# EAGLE design VAR-PBB_v01 (EAGLE 9.5.2)
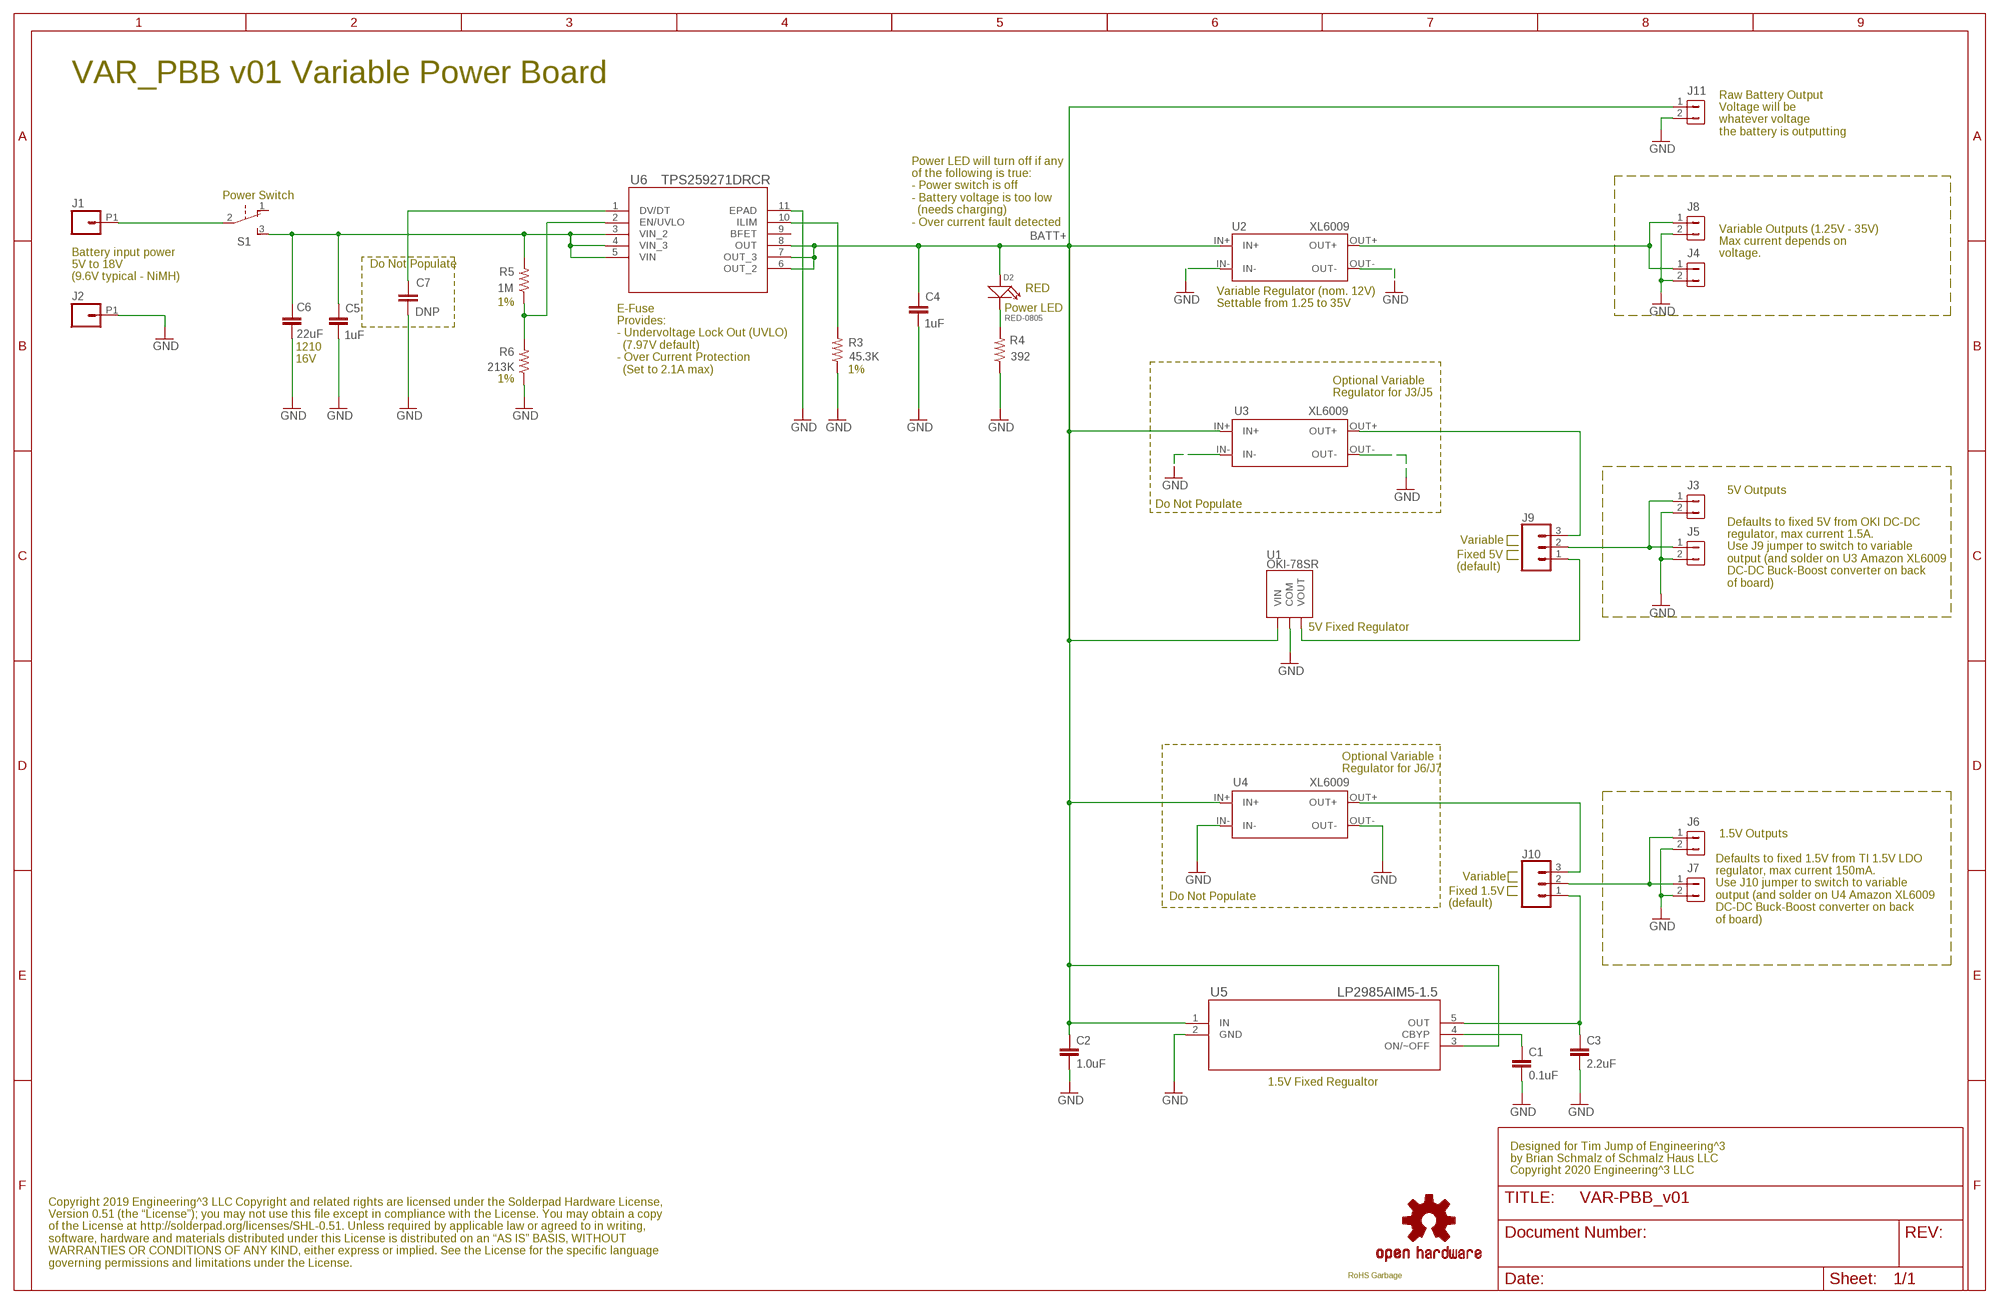
[diagram p0: schematic, sheet 1]

## Parts
C1  0.1uF  0.1UF-0603-25V-5%  [0603]
C2  1.0uF  1.0UF-0603-16V-10%  [0603]
C3  2.2uF  2.2UF-0603-10V-20%  [0603]
C4  1uF  0.1UF-0603-25V-5%  [0603]
C5  1uF  0.1UF-0603-25V-5%  [0603]
C6  22uF  22UF-1210-16V-20%  [1210]
C7  DNP  0.1UF-0603-25V-5%  [0603]
D2  RED-0805  SMD-LED-CLEAR-RED(0805)  [LED-0805]
J1  ANDERSON_POWER_POLE  [ANDERSON_POWER_POLE]
J2  ANDERSON_POWER_POLE  [ANDERSON_POWER_POLE]
J3  CON1X2_SHROUDED  [HEADER_1X2_SHROUDED]
J4  CON1X2_SHROUDED  [HEADER_1X2_SHROUDED]
J5  CON1X2_SHROUDED  [HEADER_1X2_SHROUDED]
J6  CON1X2_SHROUDED  [HEADER_1X2_SHROUDED]
J7  CON1X2_SHROUDED  [HEADER_1X2_SHROUDED]
J8  CON1X2_SHROUDED  [HEADER_1X2_SHROUDED]
J9  CONN_03  [1X03]
J10  CONN_03  [1X03]
J11  CON1X2_SHROUDED  [HEADER_1X2_SHROUDED]
LOGO2  OSHW-LOGOM  [OSHW-LOGO-M]
R3  45.3K  RESISTOR0603  [0603]
R4  392  RESISTOR0603  [0603]
R5  1M  RESISTOR0603  [0603]
R6  213K  RESISTOR0603  [0603]
S1  SWITCH_SLIDE_ON_ON  [SWITCH_SLIDE_RA]
U1  OKI-78SR  [OKI-78SR_REGULATOR_HORIZONTAL]
U2  XL6009  [XL6009_MODULE]
U3  XL6009  [XL6009_MODULE]
U4  XL6009  [XL6009_MODULE]
U5  LP2985AIM5-1.5  [MF05A]
U6  TPS259271DRCR  [DRC10_1P65X2P40]
U$6  ROHS_GARBAGE  [ROHS_GARBAGE_5MM]

## Nets
1.5V_REG: C3.1 J10.1 U5.5(OUT)
5V_REG: J9.1 U1.P$3(VOUT)
BATT+: C2.1 C4.2 D2.+ J11.1 U1.P$1(VIN) U2.IN+ U3.IN+ U4.IN+ U5.1(IN) U5.3(ON/~OFF) U6.6(OUT_2) U6.7(OUT_3) U6.8(OUT)
CHANNEL3: J3.1 J5.1 J9.2
CHANNEL4: J6.1 J7.1 J10.2
GND: C1.2 C2.2 C3.2 C4.1 C5.1 C6.2 C7.1 J2.P1 J3.2 J4.2 J5.2 J6.2 J7.2 J8.2 J11.2 R3.1 R4.1 R6.1 U1.P$2(COM) U2.IN- U2.OUT- U3.IN- U3.OUT- U4.IN- U4.OUT- U5.2(GND) U6.11(EPAD)
N$1: C5.2 C6.1 R5.2 S1.3(S) U6.3(VIN_2) U6.4(VIN_3) U6.5(VIN)
N$2: D2.- R4.2
N$3: J9.3 U3.OUT+
N$4: R5.1 R6.2 U6.2(EN/UVLO)
N$5: J4.1 J8.1 U2.OUT+
N$7: J10.3 U4.OUT+
N$8: C1.1 U5.4(CBYP)
N$11: J1.P1 S1.2(P)
N$12: R3.2 U6.10(ILIM)
N$14: C7.2 U6.1(DV/DT)
Unconnected: S1.1(O) U6.9(BFET)

## Notes on the sheet
- VAR_PBB v01 Variable Power Board
- Raw Battery Output
  Voltage will be 
  whatever voltage
  the battery is outputting
- Power Switch
- Power LED will turn off if any 
  of the following is true:
  - Power switch is off
  - Battery voltage is too low 
    (needs charging)
  - Over current fault detected
- Variable Outputs (1.25V - 35V)
  Max current depends on
  voltage.
- Do Not Populate
- Battery input power
  5V to 18V
  (9.6V typical - NiMH)
- RED
- 1%
- Variable Regulator (nom. 12V)
  Settable from 1.25 to 35V
- Power LED
- 1210
  16V
- E-Fuse
  Provides:
  - Undervoltage Lock Out (UVLO)
    (7.97V default)
  - Over Current Protection
    (Set to 2.1A max)
- 1%
- 1%
- Optional Variable
  Regulator for J3/J5
- 5V Outputs
- Do Not Populate
- Variable
- Fixed 5V
  (default)
- Defaults to fixed 5V from OKI DC-DC
  regulator, max current 1.5A.
  Use J9 jumper to switch to variable
  output (and solder on U3 Amazon XL6009 
  DC-DC Buck-Boost converter on back 
  of board)
- 5V Fixed Regulator
- Optional Variable
  Regulator for J6/J7
- 1.5V Outputs
- Variable
- Do Not Populate
- Fixed 1.5V
  (default)
- Defaults to fixed 1.5V from TI 1.5V LDO
  regulator, max current 150mA.
  Use J10 jumper to switch to variable
  output (and solder on U4 Amazon XL6009 
  DC-DC Buck-Boost converter on back 
  of board)
- 1.5V Fixed Regualtor
- Designed for Tim Jump of Engineering^3
  by Brian Schmalz of Schmalz Haus LLC
- Copyright 2020 Engineering^3 LLC
- Copyright 2019 Engineering^3 LLC Copyright and related rights are licensed under the Solderpad Hardware License, 
  Version 0.51 (the “License”); you may not use this file except in compliance with the License. You may obtain a copy 
  of the License at http://solderpad.org/licenses/SHL-0.51. Unless required by applicable law or agreed to in writing, 
  software, hardware and materials distributed under this License is distributed on an “AS IS” BASIS, WITHOUT 
  WARRANTIES OR CONDITIONS OF ANY KIND, either express or implied. See the License for the specific language 
  governing permissions and limitations under the License.

## Library data of the parts
C1 = SparkFun-Capacitors:0.1UF: 0.1µF ceramic capacitors A capacitor is a passive two-terminal electrical component used to store electrical energy temporarily in an electric field.; PROD_ID: CAP-08604
C2 = SparkFun-Capacitors:1.0UF: 1µF ceramic capacitors A capacitor is a passive two-terminal electrical component used to store electrical energy temporarily in an electric field.; PROD_ID: CAP-00868
C3 = SparkFun-Capacitors:2.2UF: 2.2µF ceramic capacitors A capacitor is a passive two-terminal electrical component used to store electrical energy temporarily in an electric field.; PROD_ID: CAP-07888
C4 C5 C7 = SparkFun-Capacitors:0.1UF: 0.1µF ceramic capacitors A capacitor is a passive two-terminal electrical component used to store electrical energy temporarily in an electric field.; PROD_ID: CAP-08604; VALUE: 0.1uF
C6 = SparkFun-Capacitors:22UF: 22µF ceramic capacitors A capacitor is a passive two-terminal electrical component used to store electrical energy temporarily in an electric field.
D2 = OPL_Optoelectronics:SMD-LED-CLEAR-RED(0805): 304090046; MPN: 17-215SURC/S530-A2/TR8
J1 J2 = JLY Parts:ANDERSON_POWER_POLE
J3-J8 J11 = JLY Parts:CON1X2_SHROUDED: CONN HDR RT ANG 2POS .100 TIN, Shrouded, Molex 70553-0036
J9 J10 = SparkFun-Connectors:CONN_03: Multi connection point. Often used as Generic Header-pin footprint for 0.1 inch spaced/style header connections On any of the 0.1 inch spaced packages, you can populate with these: Break Away Headers - Straight <https://www.sparkfun.com/products/116> (PRT-00116) Break Away Male Headers - Right Angle <https://www.sparkfun.com/products/553> (PRT-00553) Female Headers <https://www.sparkfun.com/products/115> (PRT-00115) Break Away Headers - Machine Pin <https://www.sparkfun.com/products/117> (PRT-00117) Break Away Female Headers - Swiss Machine Pin <https://www.sparkfun.com/products/743> (PRT-00743) Stackable Header - 3 Pin (Female, 0.1") <https://www.sparkfun.com/products/13875> (PRT-13875) For SCREWTERMINALS and SPRING TERMINALS visit here: Screw Terimnals on SparkFun.com <https://www.sparkfun.com/search/results?term=Screw+Terminals> (5mm/3.5mm/2.54mm spacing) This device is also useful as a general connection point to wire up your design to another part of your project. Our various solder wires solder well into these plated through hole pads. Hook-Up Wire - Assortment (Stranded, 22 AWG) <https://www.sparkfun.com/products/11375> (PRT-11375) Hook-Up Wire - Assortment (Solid Core, 22 AWG) <https://www.sparkfun.com/products/11367> (PRT-11367) View the entire wire category on our website here <https://www.sparkfun.com/categories/141> Special notes: Molex polarized connector foot print use with SKU : PRT-08232 with associated crimp pins and housings.
LOGO2 = SparkFun-Aesthetics:OSHW-LOGO: Open-Source Hardware (OSHW) Logo This logo indicates the piece of hardware it is found on incorporates a OSHW license and/or adheres to the definition of open source hardware found here: http://freedomdefined.org/OSHW
R3-R6 = SparkFun-Resistors:RESISTOR: Generic Resistor Package
S1 = JLY Parts:SWITCH_SLIDE_ON_ON: E-Switch Digikey EG2478-ND 500SSP1S1M6QEA SWITCH SLIDE SPDT SILVR 5A RTANG 500 E-Switch
U1 = OKI-78sr_Regulator:OKI-78SR
U2-U4 = XL6009_DC-DC:XL6009
U5 = LP2985AIM5-1.5:LP2985AIM5-1.5; BUILT_BY: EMA_UL_Team; COPYRIGHT: Copyright (C) 2018 Accelerated Designs. All rights reserved; MANUFACTURER_PART_NUMBER: LP2985AIM5-1.5; VENDOR: Texas Instruments
U6 = TPS259271DRCR:TPS259271DRCR; BUILT_BY: EMA_Molly; COPYRIGHT: Copyright (C) 2018 Accelerated Designs. All rights reserved; MANUFACTURER_PART_NUMBER: TPS259271DRCR; VENDOR: Texas Instruments
U$6 = SchmalzHausPublic:ROHS_GARBAGE

## Board
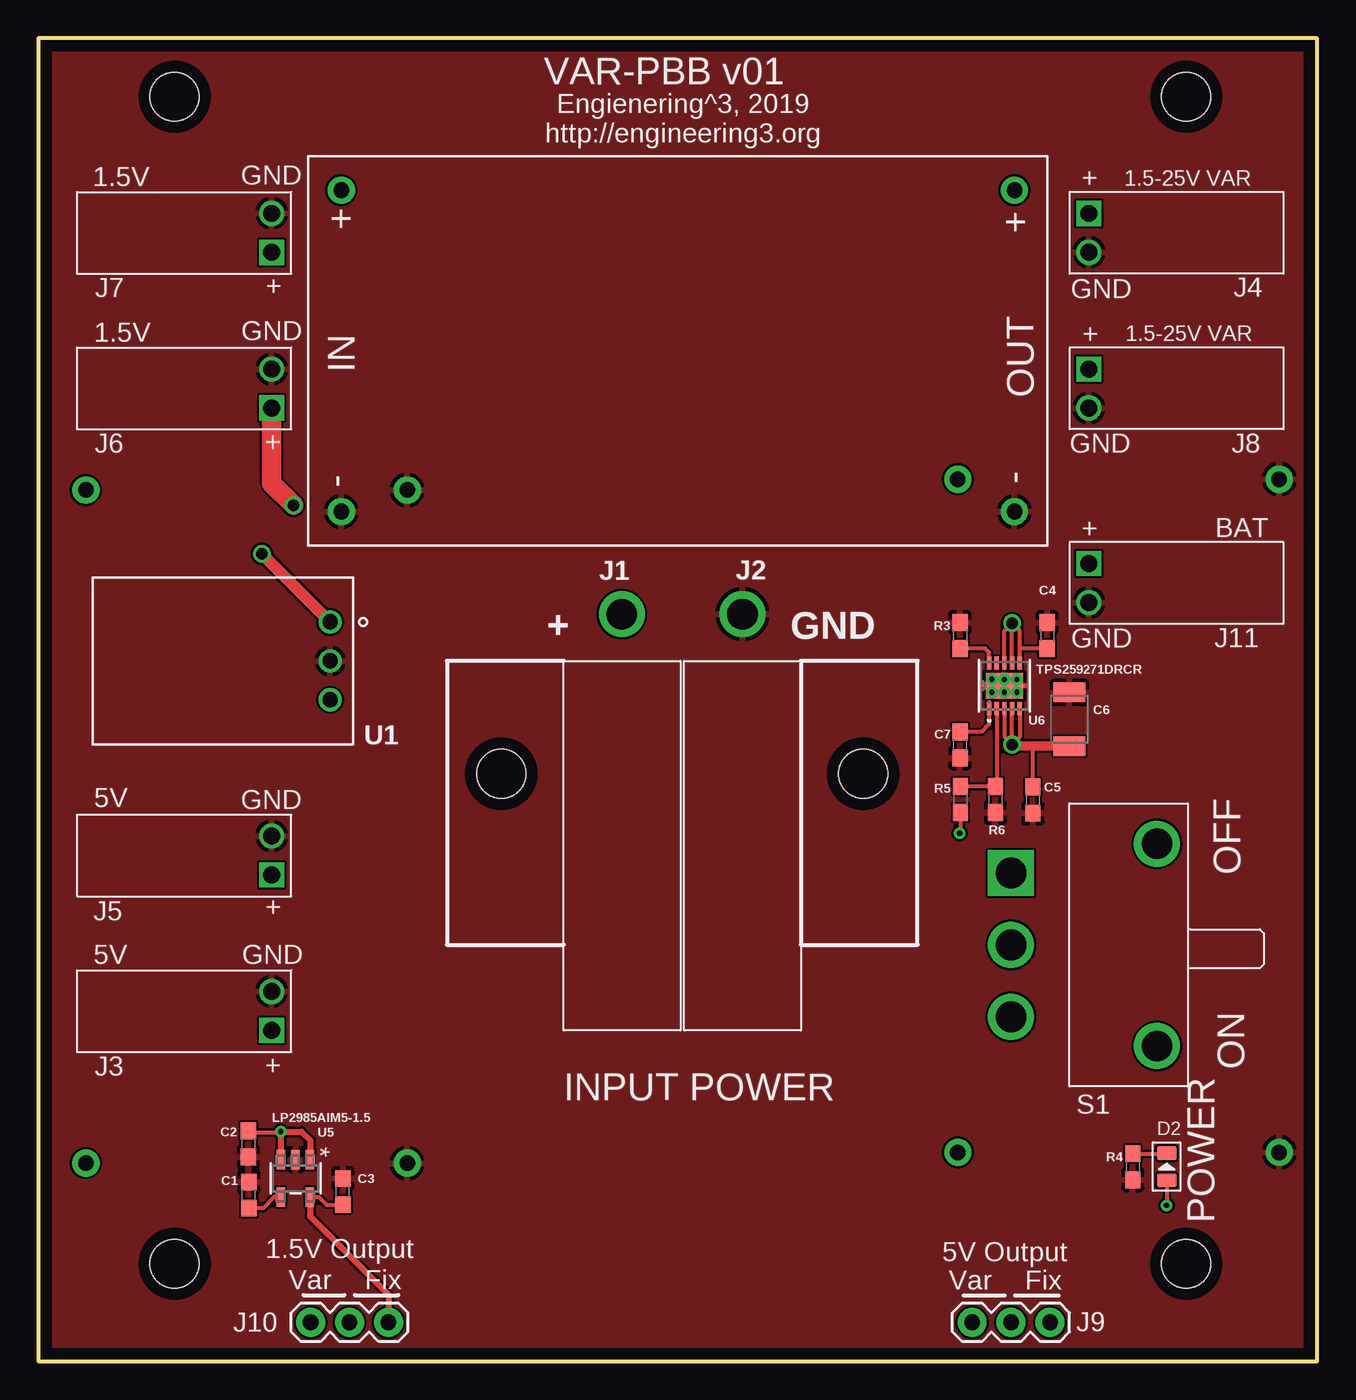
[diagram p1: board, top side]
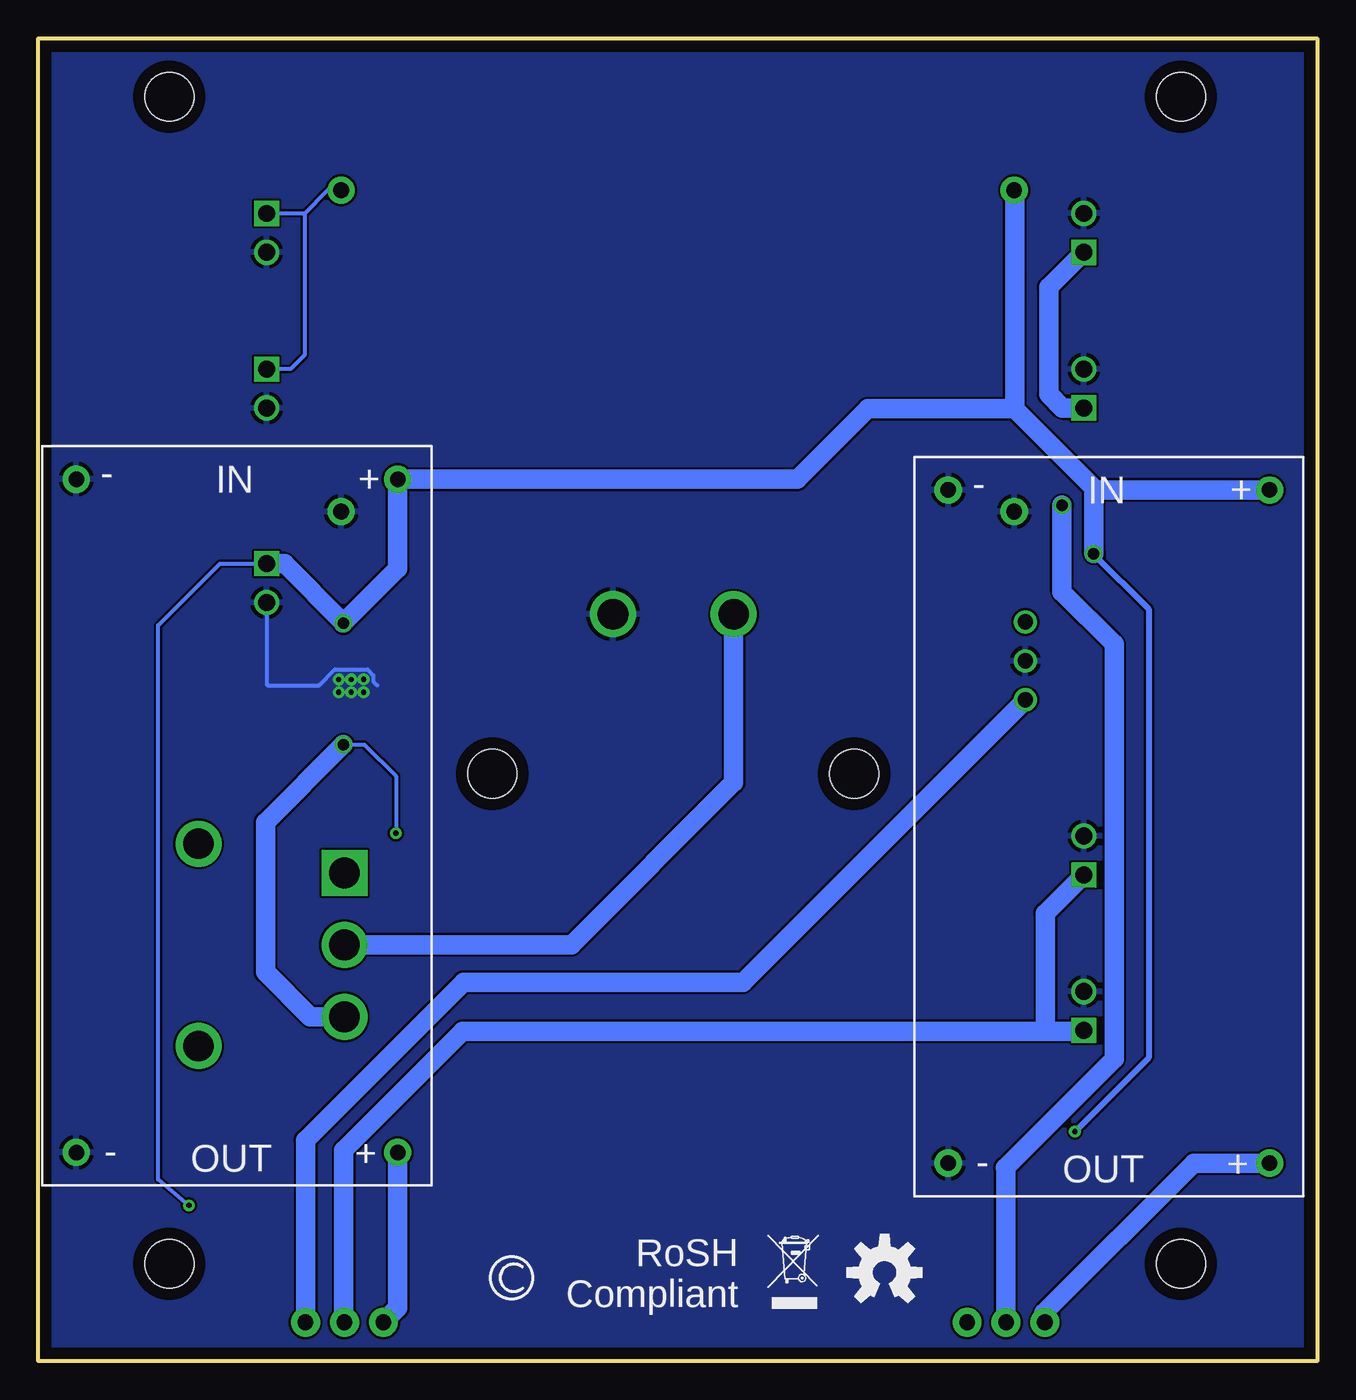
[diagram p2: board, bottom side, seen from below]

Size 83.49 x 86.36 mm. Coordinates in mm from the lower left corner, seen from the top.
Outline: 0,0 83.49,0 83.49,86.36 0,86.36 0,0
Copper layers (1*16): Top 0.035mm / dielectric 1.5mm / Bottom 0.035mm
Design rules "default *": minimum track width 10mil, minimum drill 10mil, track to track 6mil, track to pad 6mil, pad to pad 6mil, via to via 7mil, smd to smd 6mil, copper to edge 30mil, drill to drill 8mil, minimum pad ring 10mil, minimum via ring 8mil, stop-mask expansion 4mil, vias tented up to drill 0mil, thermal gap 10mil
Holes 3.2 mm at 53.85,38.35 30.23,38.35
Holes 3.17 mm at 8.89,82.55 74.93,82.55 74.93,6.35 8.89,6.35

### Footprints (pad centres in the part's own frame; a part is rotated, then mirrored left to right if it is on the bottom)
0603 = smd 1.1 x 1: 1 -0.85,0; 2 0.85,0
1210 = smd 1.27 x 2.06: 1 -1.755,0; 2 1.755,0
LED-0805 = smd 0.889 x 1.27: + -0.889,0; - 0.889,0
ANDERSON_POWER_POLE = drill 2: P1 -1.778,0
HEADER_1X2_SHROUDED = drill 1.1 square: 1 0,-1.27 | drill 1.1: 2 0,1.27
1X03 = drill 1.016 pad 1.88: 1 0,0; 2 2.54,0; 3 5.08,0
SWITCH_SLIDE_RA = drill 2 square: 1 -4.699,0 | drill 2: 2 0,0; 3 4.699,0; NC1 -6.604,9.525; NC2 6.604,9.525
OKI-78SR_REGULATOR_HORIZONTAL = drill 1: P$1 2.54,0; P$2 0,0; P$3 -2.54,0
XL6009_MODULE = drill 1.016 pad 1.778: IN+ 10.49,21.971; IN- -10.49,21.971; OUT+ 10.49,-21.971; OUT- -10.49,-21.971
MF05A = smd 1.27 x 0.559: 1 -1.219,0.953; 2 -1.219,0; 3 -1.219,-0.953; 4 1.219,-0.953; 5 1.219,0.953
DRC10_1P65X2P40 = smd 0.85 x 0.28: 1 -1.475,1; 2 -1.475,0.5; 3 -1.475,0; 4 -1.475,-0.5; 5 -1.475,-1; 6 1.475,-1; 7 1.475,-0.5; 8 1.475,0; 9 1.475,0.5; 10 1.475,1 | smd 1.65 x 2.4: 11 0,0

### Placement (x,y rotation side)
C1  13.74,10.85 90 top
C2  13.72,14.2 270 top
C3  19.89,11.07 90 top
C4  65.86,47.37 270 top
C5  64.92,36.63 90 top
C6  67.31,41.91 90 top
C7  60.17,40.23 90 top
D2  73.66,12.7 90 top
J1  38.1,46.99 270 top
J2  45.97,46.99 270 top
J3  15.24,22.86 0 top
J4  68.58,73.66 180 top
J5  15.24,33.02 0 top
J6  15.24,63.5 0 top
J7  15.24,73.66 0 top
J8  68.58,63.5 180 top
J9  66.04,2.54 180 top
J10  22.86,2.54 180 top
J11  68.58,50.8 180 top
LOGO2  28.24,5.79 0 bottom
R3  60.17,47.37 270 top
R4  71.45,12.7 90 top
R5  60.2,36.68 270 top
R6  62.48,36.68 90 top
S1  63.5,27.18 270 top
U1  19.05,45.72 90 top
U2  41.75,65.96 90 top
U3  70.52,35.6 0 bottom
U4  13.6,34.9 0 bottom
U5  16.79,11.94 270 top
U6  63.07,44.09 90 top
U$6  35.86,3.43 0 bottom

### Tracks (layer width: path | path; a pad name or v marks a point on that pad's centre or on a via)
1.5V_REG
  Top 0.254: U5.5 18.31,10.72 18.81,10.22 C3.1
  Top 0.406: U5.5 17.74,9.46 22.86,4.34 J10.1
5V_REG
  Bottom 1.27: U1.P$3 37.49,24.74 55.73,24.74 66.04,14.43 J9.1
BATT+  (via drill 0.35, 0.75)
  Top 0.254: U6.7 63.57,48.18 | 63.57,48.18 v63.58,48.18 64.07,47.69 64.07,46.53 | U6.8 63.07,47.68 63.57,48.18 | U6.6 64.07,46.53 | C4.2 64.08,46.52 64.07,46.53 | v15.82,14.99 15.82,14.94 13.83,14.94 C2.1 | 15.82,13.17 U5.3 | D2.+ v73.66,10.17
  Top 0.406: 15.82,14.94 15.82,13.17 | v15.82,14.99 17.17,14.99 17.75,14.4 17.75,13.17 U5.1
  Top 0.813: v14.61,52.7 U1.P$1
  Bottom 0.254: 19.74,76.4 U2.IN+ | 14.45,56.87 14.46,56.87 | v14.61,52.7 14.58,52.73 | v73.66,10.17 75.67,11.87 75.67,48.03 71.63,52.07 J11.1
  Bottom 0.406: v14.61,52.7 11,49.1 11,19.81 v15.82,14.99
  Bottom 1.27: J11.1 67.41,52.07 63.58,48.23 v63.58,48.18 60.03,51.73 U3.IN+ 33.94,57.57 29.34,62.18 19.74,62.18 | 19.74,62.18 19.74,76.4 | U4.IN+ 14.45,56.87 14.58,56.87 14.58,52.73 | 14.46,56.87 19.74,62.15 19.74,62.18
CHANNEL3
  Bottom 0.254: 15.29,21.54 J3.1 | 63.55,2.59 J9.2
  Bottom 1.27: J5.1 17.75,29.23 17.75,21.54 | 15.29,21.54 17.75,21.54 | 17.75,21.54 55.78,21.54 63.55,13.77 63.55,2.59
CHANNEL4  (via drill 0.75)
  Top 1.27: v16.66,55.88 15.24,57.3 J6.1
  Bottom 1.27: J10.2 20.32,12.57 20.37,12.62 13.26,19.74 13.26,46.81 16.66,50.22 v16.66,55.88 | J7.1 17.53,70.1 17.53,63.12 16.64,62.23 J6.1
GND  (via drill 0.35)
  Top 0.254: 61.54,44.09 U6.11 64.62,44.09
  Bottom 0.254: J11.2 68.58,44.17 68.53,44.12 65.17,44.12 64.13,45.16 62.01,45.16 61.62,44.77 61.62,44.37 61.37,44.12
  other vias: 62.26,44.53 63.07,44.5 63.88,44.5 63.88,43.66 63.07,43.66 62.26,43.66
  pour Bottom (rank 2): -0.02,0 83.49,0 83.49,86.36 0,86.36
  pour Top: 0,0 0,86.36 83.49,86.36 83.49,0
N$1  (via drill 0.35, 0.75)
  Top 0.254: v63.58,40.26 63.57,40.27 | 63.57,40.27 U6.4 | U6.3 63.07,40.77 63.57,40.27 | U6.5 64.07,40.75 v63.58,40.26 | R5.2 60.2,34.52 v60.15,34.47 | 63.68,40.16 v63.58,40.26 | C5.2 64.92,40.16
  Top 0.61: C6.1 64.92,40.16 63.68,40.16
  Bottom 0.254: v63.58,40.26 62.2,40.26 60.15,38.2 v60.15,34.47
  Bottom 1.27: S1.3 65.73,22.48 68.66,25.4 68.66,35.18 v63.58,40.26
N$2
  Top 0.254: R4.2 73.62,13.55 D2.-
N$3
  Bottom 1.27: U3.OUT+ 60.03,3.47 J9.3
N$4
  Top 0.254: U6.2 62.57,37.61 R6.2 R5.1
N$5
  Bottom 0.254: U2.OUT+ 64.59,76.45 66.12,74.92 | 66.12,74.92 66.12,65.68 67.03,64.77 J8.1 | J4.1 66.13,74.93 66.12,74.92
N$7
  Bottom 0.254: 17.83,2.59 J10.3
  Bottom 1.27: U4.OUT+ 8.05,12.93 17.83,3.15 17.83,2.59
N$8
  Top 0.254: U5.4 15.41,10.72 14.68,10 C1.1
N$11
  Bottom 1.27: J1.P1 38.1,37.77 48.69,27.18 S1.2
N$12
  Top 0.254: U6.10 62.07,46.26 61.8,46.53 60.18,46.53 R3.2
N$14
  Top 0.254: C7.2 61.56,41.08 62.07,41.6 U6.1

### Text on the board
tPlace: VAR-PBB v01 | Engienering^3, 2019 / http://engineering3.org | 1.5V | GND | + | 1.5-25V VAR | + | GND | 1.5V | GND | 1.5-25V VAR | + | + | GND | + | BAT | J1 | + | GND | GND | 5V | GND | OFF | + | 5V | GND | + | ON | INPUT POWER | POWER | 1.5V Output | 5V Output | Var | Fix | Var | Fix
bPlace: RoSH / Compliant